# Altium schematic sheet Sheet1.SchDoc
size A3; SheetNumber: 1; SheetTotal: 1
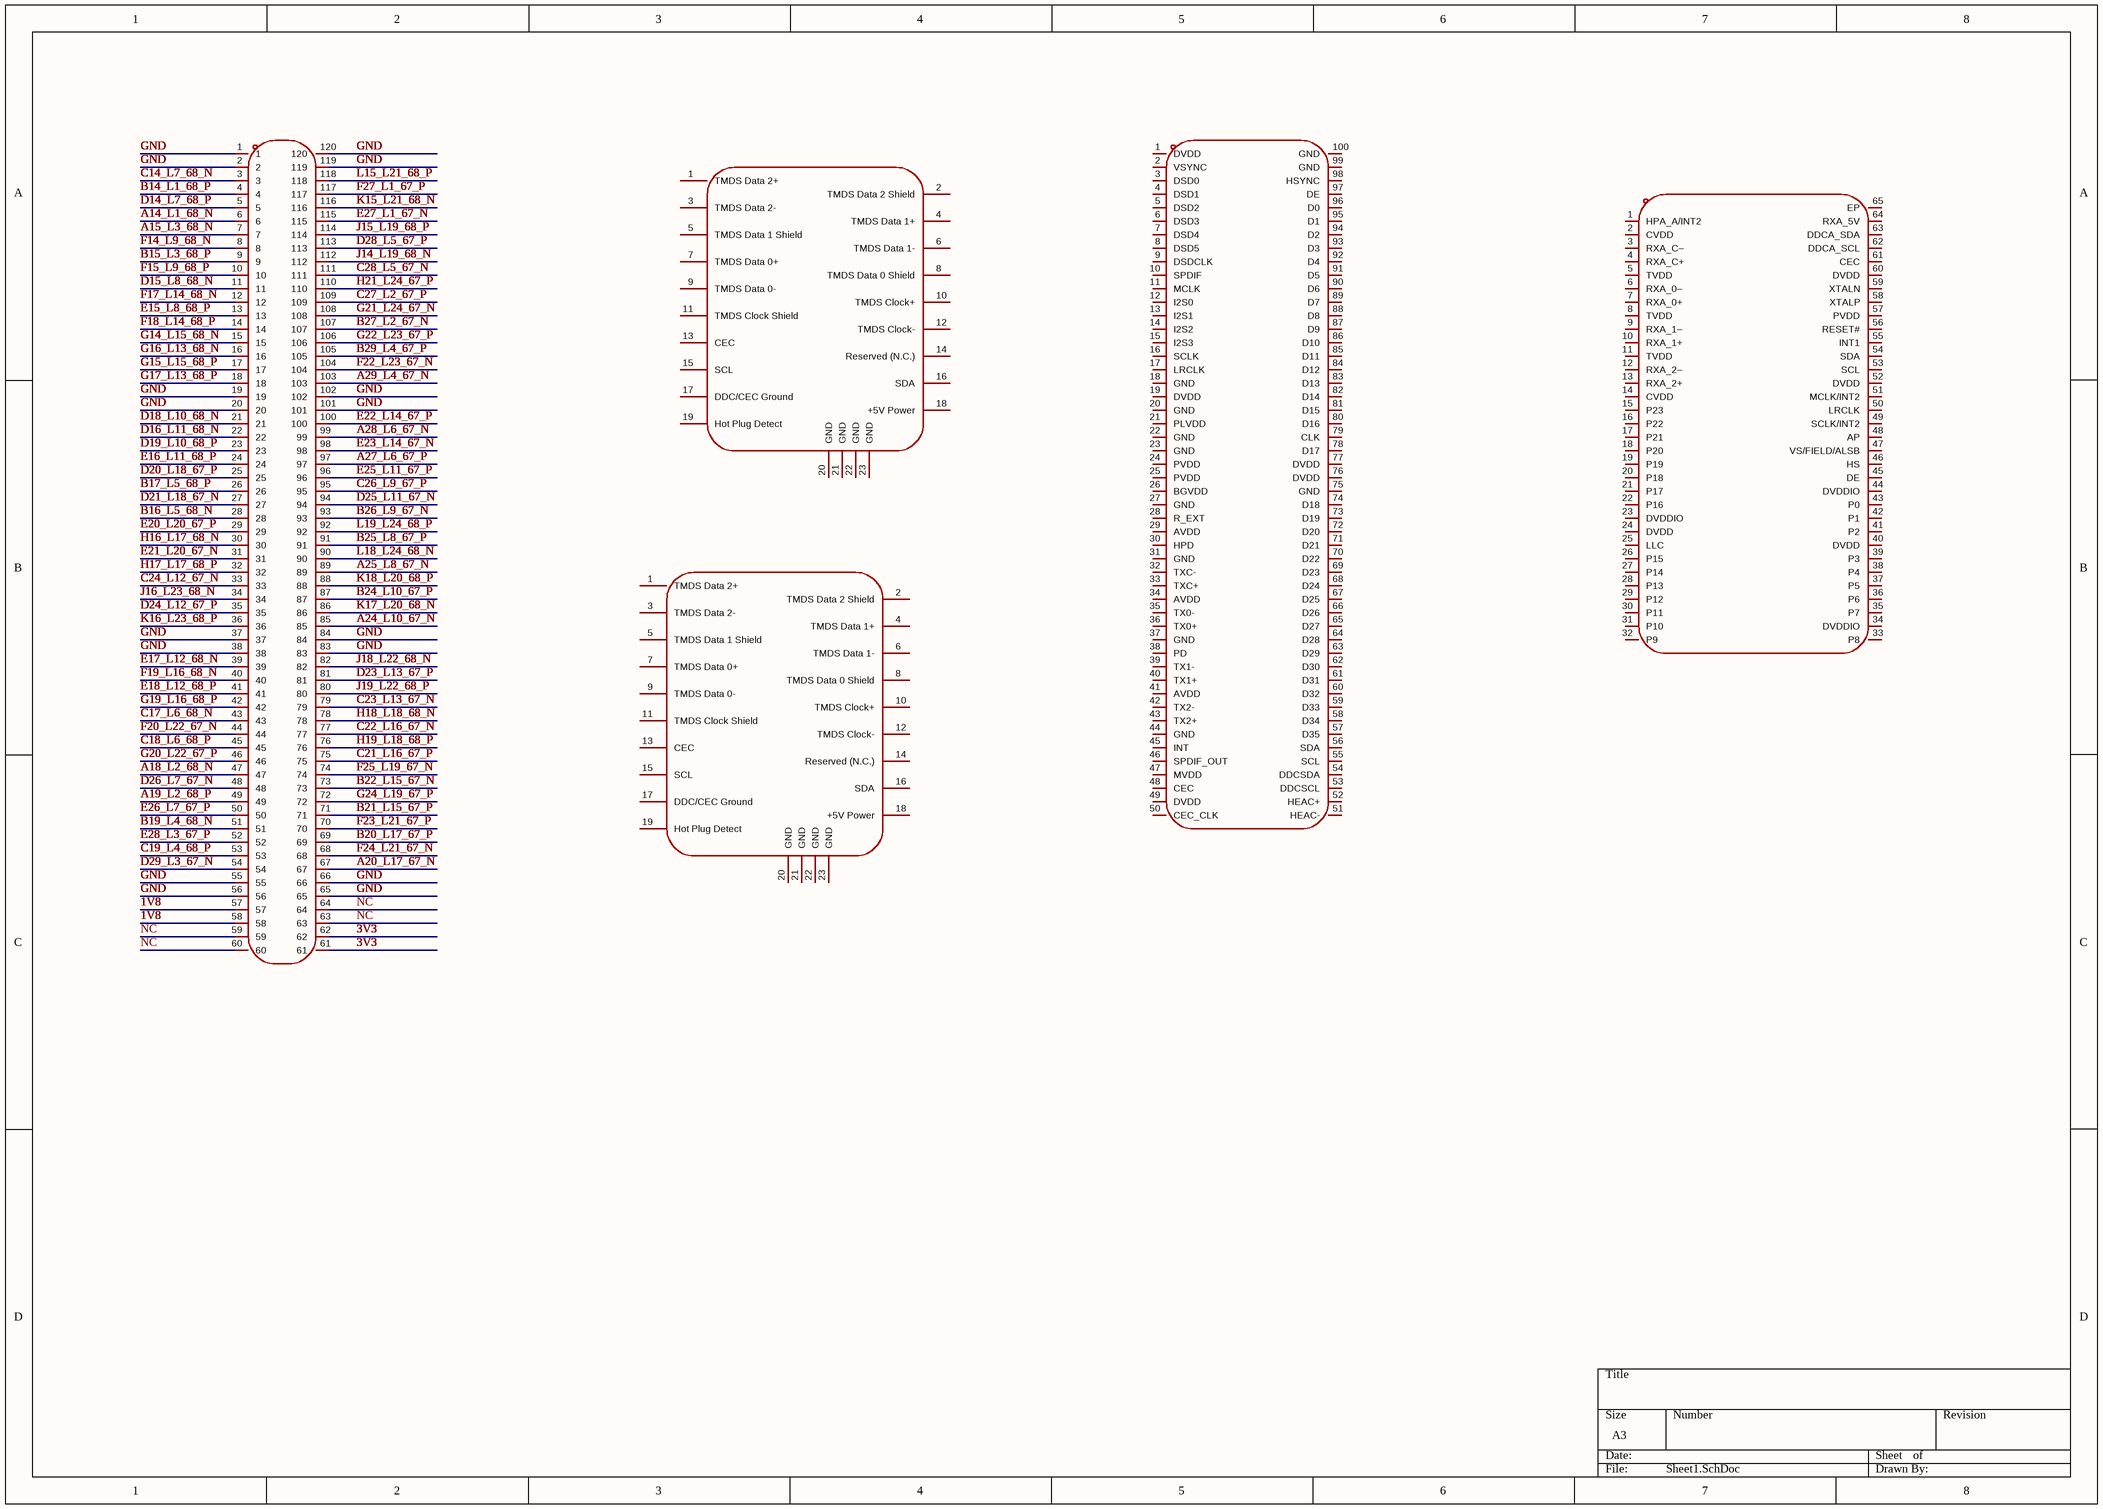
[diagram p0: Sheet1.SchDoc]

## Parts
(Parts that share a designator on the sheet are numbered #1, #2 ... from top to bottom, then left to right.)
CN?  xdb612-120p-cor  [CONN-SMD_120P-P0.80_THD0812F-120BV-GF]  (value not drawn)
U?#1  adv7611bswz-rl  [LQFP-64_L10.0-W10.0-P0.50-LS12.0-TL-EP5.3]  (value not drawn)
U?#2  adv7511kstz  [LQFP-100_L14.0-W14.0-P0.50-LS16.0-BL]  (value not drawn)
USB?#1  hdmi-001s  [HDMI-SMD_HDMI-001S]  (value not drawn)
USB?#2  hdmi-001s  [HDMI-SMD_HDMI-001S]  (value not drawn)

## Nets
1V8: CN?.57 CN?.58
3V3: CN?.61 CN?.62
A14_L1_68_N: CN?.6
A15_L3_68_N: CN?.7
A18_L2_68_N: CN?.47
A19_L2_68_P: CN?.49
A20_L17_67_N: CN?.67
A24_L10_67_N: CN?.85
A25_L8_67_N: CN?.89
A27_L6_67_P: CN?.97
A28_L6_67_N: CN?.99
A29_L4_67_N: CN?.103
B14_L1_68_P: CN?.4
B15_L3_68_P: CN?.9
B16_L5_68_N: CN?.28
B17_L5_68_P: CN?.26
B19_L4_68_N: CN?.51
B20_L17_67_P: CN?.69
B21_L15_67_P: CN?.71
B22_L15_67_N: CN?.73
B24_L10_67_P: CN?.87
B25_L8_67_P: CN?.91
B26_L9_67_N: CN?.93
B27_L2_67_N: CN?.107
B29_L4_67_P: CN?.105
C14_L7_68_N: CN?.3
C17_L6_68_N: CN?.43
C18_L6_68_P: CN?.45
C19_L4_68_P: CN?.53
C21_L16_67_P: CN?.75
C22_L16_67_N: CN?.77
C23_L13_67_N: CN?.79
C24_L12_67_N: CN?.33
C26_L9_67_P: CN?.95
C27_L2_67_P: CN?.109
C28_L5_67_N: CN?.111
D14_L7_68_P: CN?.5
D15_L8_68_N: CN?.11
D16_L11_68_N: CN?.22
D18_L10_68_N: CN?.21
D19_L10_68_P: CN?.23
D20_L18_67_P: CN?.25
D21_L18_67_N: CN?.27
D23_L13_67_P: CN?.81
D24_L12_67_P: CN?.35
D25_L11_67_N: CN?.94
D26_L7_67_N: CN?.48
D28_L5_67_P: CN?.113
D29_L3_67_N: CN?.54
E15_L8_68_P: CN?.13
E16_L11_68_P: CN?.24
E17_L12_68_N: CN?.39
E18_L12_68_P: CN?.41
E20_L20_67_P: CN?.29
E21_L20_67_N: CN?.31
E22_L14_67_P: CN?.100
E23_L14_67_N: CN?.98
E25_L11_67_P: CN?.96
E26_L7_67_P: CN?.50
E27_L1_67_N: CN?.115
E28_L3_67_P: CN?.52
F14_L9_68_N: CN?.8
F15_L9_68_P: CN?.10
F17_L14_68_N: CN?.12
F18_L14_68_P: CN?.14
F19_L16_68_N: CN?.40
F20_L22_67_N: CN?.44
F22_L23_67_N: CN?.104
F23_L21_67_P: CN?.70
F24_L21_67_N: CN?.68
F25_L19_67_N: CN?.74
F27_L1_67_P: CN?.117
G14_L15_68_N: CN?.15
G15_L15_68_P: CN?.17
G16_L13_68_N: CN?.16
G17_L13_68_P: CN?.18
G19_L16_68_P: CN?.42
G20_L22_67_P: CN?.46
G21_L24_67_N: CN?.108
G22_L23_67_P: CN?.106
G24_L19_67_P: CN?.72
GND: CN?.1 CN?.2 CN?.19 CN?.20 CN?.37 CN?.38 CN?.55 CN?.56 CN?.65 CN?.66 CN?.83 CN?.84 CN?.101 CN?.102 CN?.119 CN?.120
H16_L17_68_N: CN?.30
H17_L17_68_P: CN?.32
H18_L18_68_N: CN?.78
H19_L18_68_P: CN?.76
H21_L24_67_P: CN?.110
J14_L19_68_N: CN?.112
J15_L19_68_P: CN?.114
J16_L23_68_N: CN?.34
J18_L22_68_N: CN?.82
J19_L22_68_P: CN?.80
K15_L21_68_N: CN?.116
K16_L23_68_P: CN?.36
K17_L20_68_N: CN?.86
K18_L20_68_P: CN?.88
L15_L21_68_P: CN?.118
L18_L24_68_N: CN?.90
L19_L24_68_P: CN?.92
NC: CN?.59 CN?.60 CN?.63 CN?.64

Not connected (* = marked no-connect by the designer): U?#1 1(HPA_A/INT2) 2(CVDD) 3(RXA_C–) 4(RXA_C+) 5(TVDD) 6(RXA_0–) 7(RXA_0+) 8(TVDD) 9(RXA_1–) 10(RXA_1+) 11(TVDD) 12(RXA_2–) 13(RXA_2+) 14(CVDD) 15(P23) 16(P22) 17(P21) 18(P20) 19(P19) 20(P18) 21(P17) 22(P16) 23(DVDDIO) 24(DVDD) 25(LLC) 26(P15) 27(P14) 28(P13) 29(P12) 30(P11) 31(P10) 32(P9) 33(P8) 34(DVDDIO) 35(P7) 36(P6) 37(P5) 38(P4) 39(P3) 40(DVDD) 41(P2) 42(P1) 43(P0) 44(DVDDIO) 45(DE) 46(HS) 47(VS/FIELD/ALSB) 48(AP) 49(SCLK/INT2) 50(LRCLK) 51(MCLK/INT2) 52(DVDD) 53(SCL) 54(SDA) 55(INT1) 56(RESET#) 57(PVDD) 58(XTALP) 59(XTALN) 60(DVDD) 61(CEC) 62(DDCA_SCL) 63(DDCA_SDA) 64(RXA_5V) 65(EP); U?#2 1(DVDD) 2(VSYNC) 3(DSD0) 4(DSD1) 5(DSD2) 6(DSD3) 7(DSD4) 8(DSD5) 9(DSDCLK) 10(SPDIF) 11(MCLK) 12(I2S0) 13(I2S1) 14(I2S2) 15(I2S3) 16(SCLK) 17(LRCLK) 18(GND) 19(DVDD) 20(GND) 21(PLVDD) 22(GND) 23(GND) 24(PVDD) 25(PVDD) 26(BGVDD) 27(GND) 28(R_EXT) 29(AVDD) 30(HPD) 31(GND) 32(TXC-) 33(TXC+) 34(AVDD) 35(TX0-) 36(TX0+) 37(GND) 38(PD) 39(TX1-) 40(TX1+) 41(AVDD) 42(TX2-) 43(TX2+) 44(GND) 45(INT) 46(SPDIF_OUT) 47(MVDD) 48(CEC) 49(DVDD) 50(CEC_CLK) 51(HEAC-) 52(HEAC+) 53(DDCSCL) 54(DDCSDA) 55(SCL) 56(SDA) 57(D35) 58(D34) 59(D33) 60(D32) 61(D31) 62(D30) 63(D29) 64(D28) 65(D27) 66(D26) 67(D25) 68(D24) 69(D23) 70(D22) 71(D21) 72(D20) 73(D19) 74(D18) 75(GND) 76(DVDD) 77(DVDD) 78(D17) 79(CLK) 80(D16) 81(D15) 82(D14) 83(D13) 84(D12) 85(D11) 86(D10) 87(D9) 88(D8) 89(D7) 90(D6) 91(D5) 92(D4) 93(D3) 94(D2) 95(D1) 96(D0) 97(DE) 98(HSYNC) 99(GND) 100(GND); USB?#1 1(TMDS_Data_2+) 2(TMDS_Data_2_Shield) 3(TMDS_Data_2-) 4(TMDS_Data_1+) 5(TMDS_Data_1_Shield) 6(TMDS_Data_1-) 7(TMDS_Data_0+) 8(TMDS_Data_0_Shield) 9(TMDS_Data_0-) 10(TMDS_Clock+) 11(TMDS_Clock_Shield) 12(TMDS_Clock-) 13(CEC) 14(Reserved_(N.C.)) 15(SCL) 16(SDA) 17(DDC/CEC_Ground) 18(+5V_Power) 19(Hot_Plug_Detect) 20(GND) 21(GND) 22(GND) 23(GND); USB?#2 1(TMDS_Data_2+) 2(TMDS_Data_2_Shield) 3(TMDS_Data_2-) 4(TMDS_Data_1+) 5(TMDS_Data_1_Shield) 6(TMDS_Data_1-) 7(TMDS_Data_0+) 8(TMDS_Data_0_Shield) 9(TMDS_Data_0-) 10(TMDS_Clock+) 11(TMDS_Clock_Shield) 12(TMDS_Clock-) 13(CEC) 14(Reserved_(N.C.)) 15(SCL) 16(SDA) 17(DDC/CEC_Ground) 18(+5V_Power) 19(Hot_Plug_Detect) 20(GND) 21(GND) 22(GND) 23(GND)

## Library data of the parts
CN? = xdb612-120p-cor: PIN总数:120P;间距:0.8mm;安装方式:立贴;排数:2;额定电流:500mA;工作温度:-45℃~+80℃;; Manufacturer: LX(连欣科技); AddInBom: yes; ModelId: 534587499f204ed784a0d3d633a8bbcf; ModelTransform: 2118.10616,236.22,0,0,0,0,0.002,0,-27.559; Pitch: 0.8mm; Current Rating: 500mA; Symbol: XDB612-120P-COR; LCSC Part Name: AMP宏致同款BTB板对板PH0.8-2*60P/120PIN母座 合高5.0MM; SupplierPart: C7527742; ManufacturerPart: XDB612-120P-COR; Supplier Footprint: SMD,P=0.8mm; JLCPCB Part Class: Extended Part; Datasheet: https://item.szlcsc.com/datasheet/XDB612-120P-COR/8623463.html; Supplier: LCSC; ConvertToPcb: yes; FootprintName: CONN-SMD_120P-P0.80_THD0812F-120BV-GF; ModelName: CONN-SMD_120P-P0.80_THD0812F-120BV-GF; Number of Pins: 120P; Mounting Type: 立贴; Number of Rows: 2; Contact Material: 铜; Contact Plating: 金; Operating Temperature: -45℃~+80℃
U?#1 = adv7611bswz-rl: ADV7611提供汽车级、专业级(无HDCP)和工业级三种版本，工作温度范围为 -40 °C 至 +85 °C。是一款高质量、单输入HDMI接收器，内置HDMI兼容型接收器，支持HDMI 1.4a规定的所有强制性3D电视格式，和最高UXGA 60 Hz、8位的分辨率。它集成一个CEC控制器，支持CDC特性。具有一个音频输出端口，用于输出从HDMI流提取的音频数据。HDMI接收器具有高级静音控制器，可消除音频输出中的外来声频噪声。支持来自I2S串行器的音频流(两个音频通道)、来自S/PDIF串行器的音频流(; Manufacturer: ADI(亚德诺); AddInBom: yes; ModelId: cd9de06618c44fcf82654c43a457f83c; ModelName: LQFP-64_L10.0-W10.0-H1.4-LS12.0-P0.50; ModelTransform: 472.441,472.441,0,270,0,0,0,0,0; Symbol: ADV7611BSWZ-RL; LCSC Part Name: 低功耗165 MHz HDMI接收器; SupplierPart: C706706; ManufacturerPart: ADV7611BSWZ-RL; Supplier Footprint: LQFP-64(10x10); JLCPCB Part Class: Extended Part; Datasheet: https://item.szlcsc.com/datasheet/ADV7611BSWZ-RL/743801.html; Supplier: LCSC; ConvertToPcb: yes; FootprintName: LQFP-64_L10.0-W10.0-P0.50-LS12.0-TL-EP5.3
U?#2 = adv7511kstz: 接口类型:I2S；I2C;数据速率:-;; Manufacturer: ADI(亚德诺); AddInBom: yes; ModelId: 469e6cc70557486dbd01fd12ff814964; ModelName: LQFP-100_L14.0-W14.0-H1.4-LS16.0-P0.50; ModelTransform: 629.92,629.92,0,0,0,0,0,0,0; Voltage - Supply: 1.8V~3.3V; Symbol: ADV7511KSTZ; LCSC Part Name: 225 MHz, 高性能HDMI发射器带ARC; SupplierPart: C179459; ManufacturerPart: ADV7511KSTZ; Supplier Footprint: LQFP-100(14x14); JLCPCB Part Class: Extended Part; Datasheet: https://item.szlcsc.com/datasheet/ADV7511KSTZ/190853.html; Supplier: LCSC; ConvertToPcb: yes; FootprintName: LQFP-100_L14.0-W14.0-P0.50-LS16.0-BL; Interface: I2S；I2C; Data Rate: -; Operating Temperature: 0℃~+70℃; Supply Current: -; Quiescent Supply Current: -; Features: 中断生成
USB?#1 USB?#2 = hdmi-001s: 19PIN A型前插后贴HDMI插座 铜壳; Manufacturer: XUNPU(讯普); AddInBom: yes; ModelId: 95350f9f774e4f059b8c605506db97f9; ModelTransform: 590.5878,468.503,0,0,0,0,0,-79.567,-85.039; Connector Type: HDMI-A; Gender: 母; Symbol: HDMI-001S; LCSC Part Name: HDMI-A 母 19P; SupplierPart: C720616; ManufacturerPart: HDMI-001S; Supplier Footprint: SMD; JLCPCB Part Class: Extended Part; Datasheet: https://item.szlcsc.com/datasheet/HDMI-001S/763623.html; Supplier: LCSC; ConvertToPcb: yes; FootprintName: HDMI-SMD_HDMI-001S; ModelName: HDMI-SMD_HDMI-001S; Number of Pins: 19P; Mounting Type: 卧贴; Current Rating: -; Voltage Rating: -; Operating Temperature: -